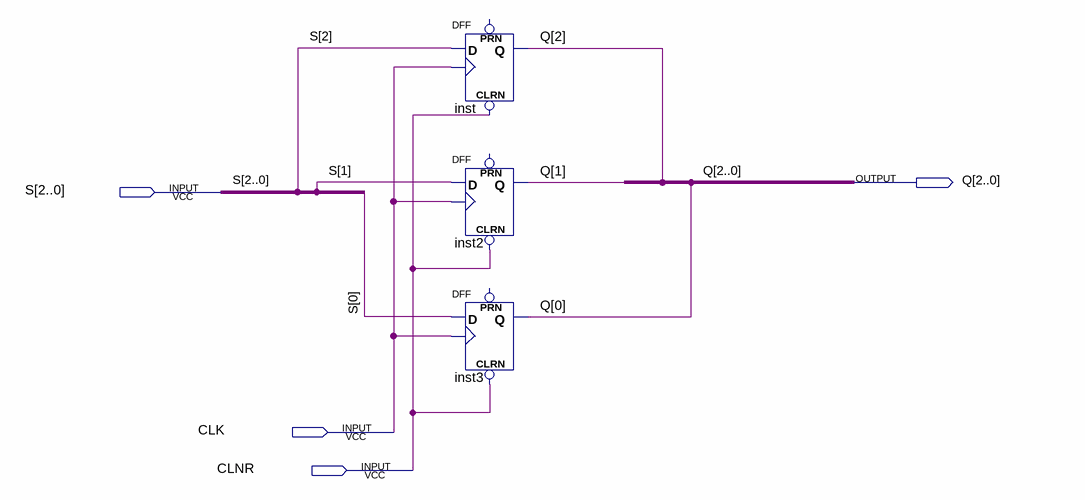
[diagram p0: schematic sheet]
// Quartus schematic BitRegister.bdf as structural Verilog: 3 symbols, 4 pins
module BitRegister (
  input  [2:0] S,
  input  CLK,
  input  CLNR,
  output [2:0] Q
);

  DFF inst (.CLRN(CLNR), .CLK(CLK), .D(S[2]), .Q(Q[2]));  // open: PRN
  DFF inst2 (.CLRN(CLNR), .CLK(CLK), .D(S[1]), .Q(Q[1]));  // open: PRN
  DFF inst3 (.CLRN(CLNR), .CLK(CLK), .D(S[0]), .Q(Q[0]));  // open: PRN
endmodule
